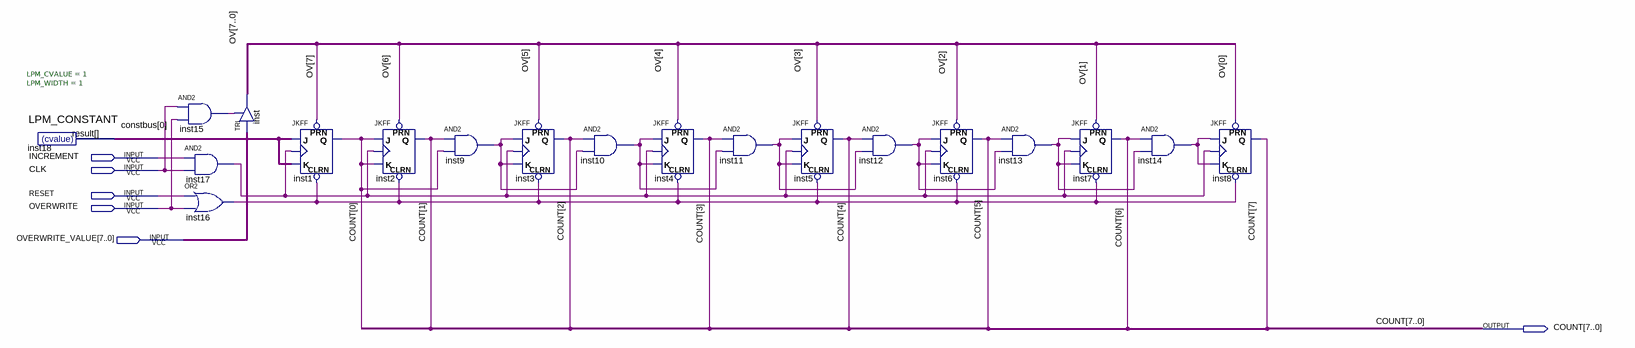
[diagram p0: schematic sheet]
// Quartus schematic PC.bdf as structural Verilog: 19 symbols, 6 pins
module PC (
  input  INCREMENT,
  input  CLK,
  input  RESET,
  input  OVERWRITE,
  input  [7:0] OVERWRITE_VALUE,
  output [7:0] COUNT
);

  wire inst9_out, inst10_out, inst11_out, inst12_out, inst13_out, inst14_out, inst15_out, inst16_out,
       inst17_out;
  wire [0:0] constbus;
  wire [7:0] OV;

  LPM_CONSTANT #(.LPM_CVALUE(1), .LPM_WIDTH(1)) inst18 (.result(constbus[0]));
  and inst15 (inst15_out, CLK, OVERWRITE);
  and inst17 (inst17_out, INCREMENT, CLK);
  or inst16 (inst16_out, RESET, OVERWRITE);
  TRI inst[7:0] (.IN(OVERWRITE_VALUE), .OE(inst15_out), .OUT(OV));
  JKFF inst1 (.PRN(OV[7]), .CLRN(inst16_out), .K(constbus[0]), .J(constbus[0]), .CLK(inst17_out), .Q(COUNT[0]));
  JKFF inst2 (.PRN(OV[6]), .CLRN(inst16_out), .K(COUNT[0]), .J(COUNT[0]), .CLK(inst17_out), .Q(COUNT[1]));
  and inst9 (inst9_out, COUNT[1], COUNT[0]);
  JKFF inst3 (.PRN(OV[5]), .CLRN(inst16_out), .K(inst9_out), .J(inst9_out), .CLK(inst17_out), .Q(COUNT[2]));
  and inst10 (inst10_out, COUNT[2], inst9_out);
  JKFF inst4 (.PRN(OV[4]), .CLRN(inst16_out), .K(inst10_out), .J(inst10_out), .CLK(inst17_out), .Q(COUNT[3]));
  and inst11 (inst11_out, COUNT[3], inst10_out);
  JKFF inst5 (.PRN(OV[3]), .CLRN(inst16_out), .K(inst11_out), .J(inst11_out), .CLK(inst17_out), .Q(COUNT[4]));
  and inst12 (inst12_out, COUNT[4], inst11_out);
  JKFF inst6 (.PRN(OV[2]), .CLRN(inst16_out), .K(inst12_out), .J(inst12_out), .CLK(inst17_out), .Q(COUNT[5]));
  and inst13 (inst13_out, COUNT[5], inst12_out);
  JKFF inst7 (.PRN(OV[1]), .CLRN(inst16_out), .K(inst13_out), .J(inst13_out), .CLK(inst17_out), .Q(COUNT[6]));
  and inst14 (inst14_out, COUNT[6], inst13_out);
  JKFF inst8 (.PRN(OV[0]), .CLRN(inst16_out), .K(inst14_out), .J(inst14_out), .CLK(inst17_out), .Q(COUNT[7]));
endmodule
